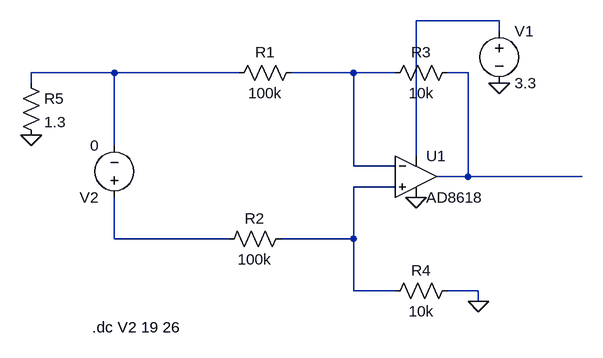
[diagram p0: schematic Battery_Diff_Amp.asc]
Battery_Diff_Amp.asc, the LTspice schematic file:
Version 4
SHEET 1 880 680
WIRE 304 -112 176 -112
WIRE 304 -96 304 -112
WIRE -288 -32 -416 -32
WIRE -96 -32 -288 -32
WIRE 80 -32 -16 -32
WIRE 144 -32 80 -32
WIRE 256 -32 224 -32
WIRE -416 -16 -416 -32
WIRE -288 80 -288 -32
WIRE 176 96 176 -112
WIRE 80 112 80 -32
WIRE 144 112 80 112
WIRE 256 128 256 -32
WIRE 256 128 208 128
WIRE 432 128 256 128
WIRE 144 144 80 144
WIRE -288 224 -288 160
WIRE -112 224 -288 224
WIRE 80 224 80 144
WIRE 80 224 -32 224
WIRE 80 304 80 224
WIRE 144 304 80 304
WIRE 272 304 224 304
WIRE 272 320 272 304
FLAG 176 160 0
FLAG 304 -16 0
FLAG 272 320 0
FLAG -416 64 0
SYMBOL Opamps\\AD8618 176 64 R0
SYMATTR InstName U1
SYMBOL voltage 304 -112 R0
SYMATTR InstName V1
SYMATTR Value 3.3
SYMBOL voltage -288 176 R180
WINDOW 123 0 0 Left 0
WINDOW 39 0 0 Left 0
SYMATTR InstName V2
SYMATTR Value 0
SYMBOL res 0 -48 R90
WINDOW 0 0 56 VBottom 2
WINDOW 3 32 56 VTop 2
SYMATTR InstName R1
SYMATTR Value 100k
SYMBOL res -16 208 R90
WINDOW 0 0 56 VBottom 2
WINDOW 3 32 56 VTop 2
SYMATTR InstName R2
SYMATTR Value 100k
SYMBOL res 240 -48 R90
WINDOW 0 0 56 VBottom 2
WINDOW 3 32 56 VTop 2
SYMATTR InstName R3
SYMATTR Value 10k
SYMBOL res 240 288 R90
WINDOW 0 0 56 VBottom 2
WINDOW 3 32 56 VTop 2
SYMATTR InstName R4
SYMATTR Value 10k
SYMBOL res -432 -32 R0
SYMATTR InstName R5
SYMATTR Value 1.3
TEXT -322 360 Left 2 !.dc V2 19 26

The netlist it stands for:
* Battery_Diff_Amp.asc
XU1 N005 N003 N001 0 N004 AD8618  ; pins In+ In- V+ V- OUT
V1 N001 0 3.3
V2 N006 N002 0
R1 N003 N002 100k
R2 N005 N006 100k
R3 N004 N003 10k
R4 0 N005 10k
R5 N002 0 1.3
.dc V2 19 26
.backanno
.end